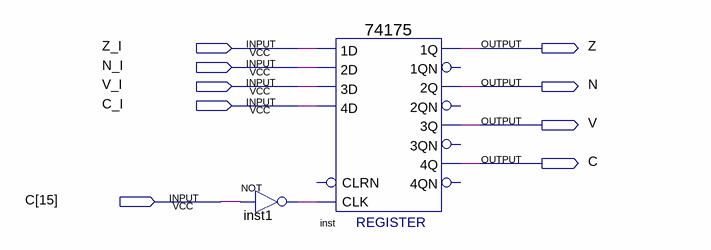
[diagram p0: schematic sheet]
// Quartus schematic TRISCFLAG.bdf as structural Verilog: 2 symbols, 9 pins
module TRISCFLAG (
  input  Z_I,
  input  N_I,
  input  V_I,
  input  C_I,
  input  [15:15] C,
  output Z,
  output N,
  output V,
  output C_1bit
);

  wire inst1_out;

  not inst1 (inst1_out, C[15]);
  \74175  inst (
    .CLK(inst1_out), .\3D (V_I), .\2D (N_I), .\1D (Z_I), .\4D (C_I), .\1Q (Z), .\3Q (V), .\2Q (N),
    .\4Q (C_1bit));  // open: CLRN, 1QN, 2QN, 4QN, 3QN
endmodule
